# Altium schematic sheet Sheet1.SchDoc
size A; SheetNumber: 1; SheetTotal: 2
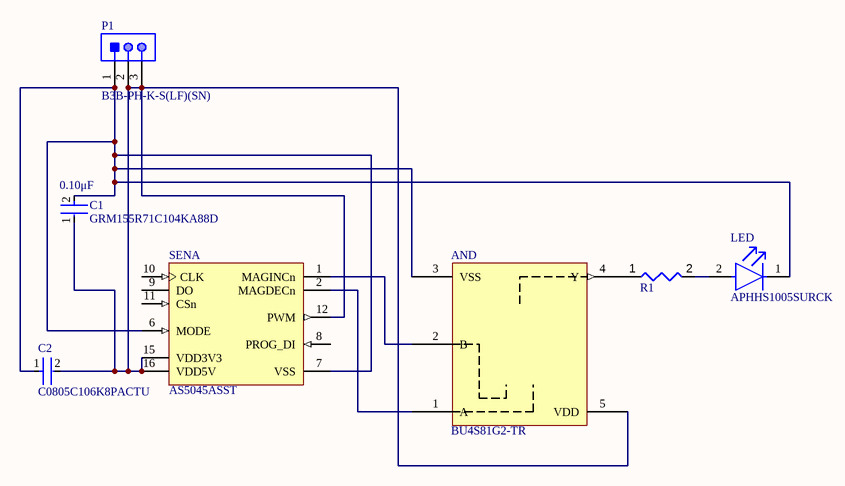
[diagram p0: Sheet1.SchDoc]

## Parts
AND  BU4S81G2-TR  [TSOP95P280X125-5M]
C1  GRM155R71C104KA88D  Capacitance: 0.10μF  [FP-GRM15-MFG]
C2  C0805C106K8PACTU  [FP-C0805C-DG-MFG]
LED  APHHS1005SURCK  [FP-APHHS1005SURCK-MFG]
P1  B3B-PH-K-S(LF)(SN)  [JST-B3B-PH-K-S-3_V]
R1  RN73H1JTTD1453F100  [RESC1608X06M]  (value not drawn)
SEN  AS5045ASST  [AMS-SSOP-16-6200X5300DE_A_L]  (part A of 2)

## Nets
NetAND_1: AND.1(A) SEN.2(MAGDECn)
NetAND_2: AND.2(B) SEN.1(MAGINCn)
NetAND_3: AND.3(VSS) C1.2 C2.1 LED.1(C) P1.1 SEN.6(MODE) SEN.7(VSS)
NetAND_4: AND.4(Y) R1.1
NetAND_5: AND.5(VDD) C1.1 C2.2 P1.2 P1.3 SEN.12(PWM) SEN.15(VDD3V3) SEN.16(VDD5V)
NetLED_2: LED.2(A) R1.2

Not connected (* = marked no-connect by the designer): SEN 8(PROG_DI) 9(DO) 10(CLK) 11(CSn)

## Library data of the parts
AND = CMP-016-00010-1: Single 2-Input AND Gate, SSOP5, RoHS
C1 = CMP-2100-03641-2: CAP CER 0.1UF 16V X7R 0402; Manufacturer: Murata; Standoff Height: 0mm; Tolerance: 10%; Voltage Rating: 16Vdc; Material: Ceramic; Value: 0.10μF; RoHS: TRUE; Manufacturer Part Number: GRM155R71C104KA88D; Temperature Characteristic: X7R; Octopart: https://octopart.com/grm155r71c104ka88d-murata-196880; Digikey Description: CAP CER 0.1UF 16V X7R 0402; Device Class L3: Ceramic Capacitors; Height: 0.55mm; ComponentLink2Description: Datasheet; Temperature Range Low: -55°C; Ipc Land Pattern Name: CAPC10050X219; ComponentLink2URL: https://search.murata.co.jp/Ceramy/image/img/A01X/G101/ENG/GRM155R71H471KA01-01A.pdf; Device Class L1: Passive Components; Lead Free: yes; Category: Cap; Package: GRM15; Temperature: -55°C to +125°C; Device Class L2: Capacitors; Temperature Range High: +125°C; Mouser Description: 0402 0.1 uF 16V ±10 % Tolerance X7R SMT Multilayer Ceramic Capacitor
C2 = CMP-2007-03243-2: CAP CER 10UF 10V X5R 0805; Manufacturer: Kemet; 3DS Part Number: 220-00001; Tolerance: 10%; Temperature Coefficient: 15%; Material: Ceramic; Device Class L2: Capacitors; Device Class L1: Passive Components; ComponentLink2URL: https://content.kemet.com/datasheets/KEM_C1006_X5R_SMD.pdf; Height: 1.4mm; Lead Free: Yes; Manufacturer Part Number: C0805C106K8PACTU; Digikey Description: CAP CER 10UF 10V X5R 0805; Octopart: https://octopart.com/c0805c106k8pactu-kemet-98697; Capacitance: 10uF; Value: 10uF; Temperature Range Low: -55°C; Temperature: -55°C to +85°C; Automotive: No; Mouser Description: CAP CER 10UF 10V X5R 0805; Ipc Land Pattern Name: CAPC200125X125; Temperature Range High: +85°C; Voltage: 10V; RoHS: TRUE; Device Class L3: Ceramic Capacitors; ComponentLink2Description: Datasheet; Voltage Rating: 10V; Package: C0805C-DG; Temperature Characteristic: X5R; Category: Cap
LED = CMP-2000-05787-2: LED RED CLEAR CHIP SMD; Forward Current: 20mA; Number of LEDs: 1; Dominant Wavelength: 630nm; Luminous Intensity: 220mcd; Wavelength: 635nm; Forward Voltage: 1.95V; Viewing Angle: 120°; Case/Package: 0402; Length: 1mm; Packaging: Tape and Reel; Lens Color: Clear; Width: 0.5mm; Test Current: 20mA; Lead Free: Lead Free; Min Operating Temperature: -40°C; Illumination Color: Red; Max Operating Temperature: 85°C; Mount: Surface Mount; Package Quantity: 2000; Lens Style: Clear; Case Code (Imperial): 0402; Height: 0.6mm; Number of Pins: 2; Case Code (Metric): 1005; Color: Red
P1 = CMP-2000-05164-1: Male Header, Pitch 2 mm, 1 x 3 Position, Height 6 mm, Tail Length 3.4 mm, -25 to 85 degC, RoHS, Bulk; Manufacturer: JST; Style/Orientation: StraightHeader/Plug; Pitch: 2mm; No of Positions: 3; Termination: Crimp; Manufacturer URL: http://www.jst.com/home2.html; Datasheet Version: Oct-06; Type: ShroudedHeader; Datasheet URL: https://datasheet.ciiva.com/11746/0900766b80826550-11746939.pdf
R1 = RN73H1JTTD1453F100-1: Res, 145K, 1%, 0.1W, 0603 Rohs Compliant: Yes
SEN = CMP-0555-00017-2: 12 Bit Programmable Magnetic Rotary Encoder, 3.3 or 5 V, SSOP-16, Pb-Free, Reel; Manufacturer: AMS; Supply Voltage (V): 3.3 or 5.0; Resolution: 12 bit; Output: absolute serial SSI, PWM; ComponentLink1Description: Manufacturer URL; Mounting Technology: Surface Mount; PackageDescription: 16-Pin Shrink Small Outline Package, 6.2 x 5.3 mm Body, 0.65 mm Pitch; PartNumber: AS5045ASST; ComponentLink2Description: Datasheet; ComponentLink2URL: http://www.ams.com/eng/content/download/1288/7223/496; PackageVersion: Rev. 1.7, 06/2010; Features: pin-compatible to AS5040, higher resolution; ComponentLink1URL: www.ams.com; DatasheetVersion: Rev. 1.7; PackageReference: SSOP-16; Code_JEDEC: MO - 150 AC